# Altium project ESP32_Weather.PrjPcb
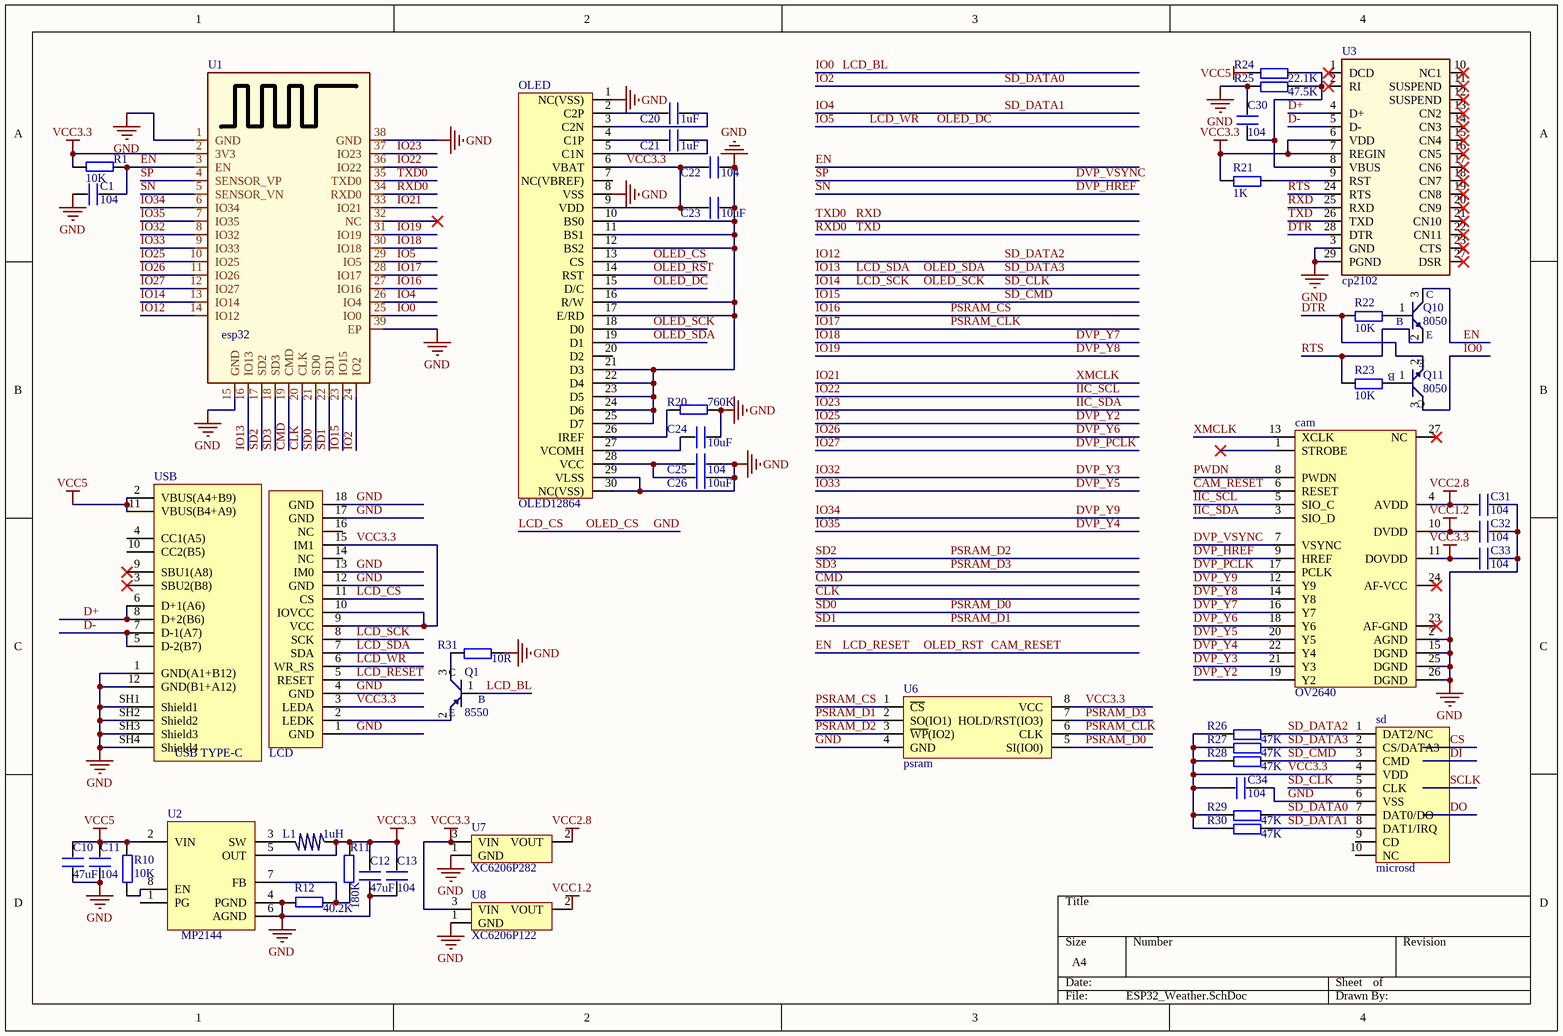
[diagram p0: ESP32_Weather.SchDoc]
1 sheet, 48 parts. Net scope: global (net labels, ports and power ports of the same name join across sheets).
Board file: ESP32_Weather.PcbDoc

## Sheet ESP32_Weather.SchDoc
size A4

### Parts
C1  104  [C 0603_L]
C10  47uF  [C 0805_L]
C11  104  [C 0603_L]
C12  47uF  [C 0805_L]
C13  104  [C 0603_L]
C20  1uF  [C 0603_L]
C21  1uF  [C 0603_L]
C22  104  [C 0603_L]
C23  10uF  [C 0603_L]
C24  10uF  [C 0603_L]
C25  104  [C 0603_L]
C26  10uF  [C 0603_L]
C30  104  [C 0603_L]
C31  104  [C 0603_L]
C32  104  [C 0603_L]
C33  104  [C 0603_L]
C34  104  [C 0603_L]
cam  OV2640  [OV5640]
L1  1uH  [NR3015]
LCD  LCD-TFT-H13TS38A  [TFT-H13TS43B]  (value not drawn)
OLED  OLED12864  [OLED_0.96]
Q1  8550  [SOT23-3L]
Q10  8050  [SOT23-3L]
Q11  8050  [SOT23-3L]
R1  10K  [R 0603_L]
R10  10K  [R 0603_L]
R11  180K  [R 0603_L]
R12  40.2K  [R 0603_L]
R20  760K  [R 0603_L]
R21  1K  [R 0603_L]
R22  10K  [R 0603_L]
R23  10K  [R 0603_L]
R24  22.1K  [R 0603_L]
R25  47.5K  [R 0603_L]
R26  47K  [R 0603_L]
R27  47K  [R 0603_L]
R28  47K  [R 0603_L]
R29  47K  [R 0603_L]
R30  47K  [R 0603_L]
R31  10R  [R 0603_L]
sd  microsd  [microsd3]
U1  esp32  [ESP32]
U2  MP2144  [SOT23-8L]
U3  cp2102  [QFN28 5x5_N]
U6  psram  [SOP8_L]
U7  XC6206P282  [SOT23-3L]
U8  XC6206P122  [SOT23-3L]
USB  USB TypeC  [USB Type-C]  (value not drawn)

### Nets
GND: C1.1 C10.1 C11.1 C12.1 C13.1 C22.1 C23.1 C24.1 C25.1 C26.1 C30.1 C31.2 C32.2 C33.2 C34.2 cam.2(AGND) cam.15(DGND) cam.25(DGND) cam.26(DGND) LCD.1(GND) LCD.4(GND) LCD.11(CS) LCD.12(GND) LCD.13(IM0) LCD.17(GND) LCD.18(GND) OLED.1(NC(VSS)) OLED.8(VSS) OLED.10(BS0) OLED.11(BS1) OLED.12(BS2) OLED.13(CS) OLED.16(R/W) OLED.17(E/RD) OLED.21(D3) OLED.22(D4) OLED.23(D5) OLED.24(D6) OLED.25(D7) OLED.29(VLSS) OLED.30(NC(VSS)) R12.2 R20.1 R25.1 R31.2 sd.6(VSS) U1.1(GND) U1.15(GND) U1.38(GND) U1.39(EP) U2.4(PGND) U2.6(AGND) U3.3(GND) U3.29(PGND) U6.4(GND) U7.1(GND) U8.1(GND) USB.1(GND(A1+B12)) USB.12(GND(B1+A12)) USB.SH1(Shield1) USB.SH2(Shield2) USB.SH3(Shield3) USB.SH4(Shield4)  [also labelled LCD_CS, OLED_CS]
VCC1.2: C32.1 cam.10(DVDD) U8.2(VOUT)
VCC2.8: C31.1 cam.4(AVDD) U7.2(VOUT)
VCC3.3: C12.2 C13.2 C22.2 C23.2 C33.1 C34.1 cam.11(DOVDD) L1.1 LCD.3(LEDA) LCD.9(VCC) LCD.10(IOVCC) LCD.15(IM1) OLED.6(VBAT) OLED.9(VDD) R1.2 R11.1 R21.1 R26.1 R27.1 R28.1 R29.1 R30.1 sd.4(VDD) U1.2(3V3) U2.5(OUT) U3.6(VDD) U3.7(REGIN) U6.8(VCC) U7.3(VIN) U8.3(VIN)
VCC5: C10.2 C11.2 R10.2 R24.1 U2.2(VIN) USB.2(VBUS(A4+B9)) USB.11(VBUS(B4+A9))
CAM_RESET: C1.2 cam.6(RESET) LCD.5(RESET) OLED.14(RST) Q10.3(C) R1.1 U1.3(EN)  [also labelled EN, LCD_RESET, OLED_RST]
CLK: U1.20(CLK)
CMD: U1.19(CMD)
D+: U3.4(D+) USB.6(D+1(A6)) USB.8(D+2(B6))
D-: U3.5(D-) USB.5(D-2(B7)) USB.7(D-1(A7))
DTR: Q11.2(E) R22.1 U3.28(DTR)
DVP_HREF: cam.9(HREF) U1.5(SENSOR_VN)  [also labelled SN]
DVP_PCLK: cam.17(PCLK) U1.12(IO27)  [also labelled IO27]
DVP_VSYNC: cam.7(VSYNC) U1.4(SENSOR_VP)  [also labelled SP]
DVP_Y2: cam.19(Y2) U1.10(IO25)  [also labelled IO25]
DVP_Y3: cam.21(Y3) U1.8(IO32)  [also labelled IO32]
DVP_Y4: cam.22(Y4) U1.7(IO35)  [also labelled IO35]
DVP_Y5: cam.20(Y5) U1.9(IO33)  [also labelled IO33]
DVP_Y6: cam.18(Y6) U1.11(IO26)  [also labelled IO26]
DVP_Y7: cam.16(Y7) U1.30(IO18)  [also labelled IO18]
DVP_Y8: cam.14(Y8) U1.31(IO19)  [also labelled IO19]
DVP_Y9: cam.12(Y9) U1.6(IO34)  [also labelled IO34]
IIC_SCL: cam.5(SIO_C) U1.36(IO22)  [also labelled IO22]
IIC_SDA: cam.3(SIO_D) U1.37(IO23)  [also labelled IO23]
IO0: Q1.1(B) Q11.3(C) U1.25(IO0)  [also labelled LCD_BL]
IO2: R29.2 sd.7(DAT0/DO) U1.24(IO2)  [also labelled SD_DATA0]
IO4: R30.2 sd.8(DAT1/IRQ) U1.26(IO4)  [also labelled SD_DATA1]
IO5: LCD.6(WR_RS) OLED.15(D/C) U1.29(IO5)  [also labelled LCD_WR, OLED_DC]
IO12: R26.2 sd.1(DAT2/NC) U1.14(IO12)  [also labelled SD_DATA2]
IO13: LCD.7(SDA) OLED.19(D1) R27.2 sd.2(CS/DATA3) U1.16(IO13)  [also labelled LCD_SDA, OLED_SDA, SD_DATA3]
IO14: LCD.8(SCK) OLED.18(D0) sd.5(CLK) U1.13(IO14)  [also labelled LCD_SCK, OLED_SCK, SD_CLK]
IO15: R28.2 sd.3(CMD) U1.23(IO15)  [also labelled SD_CMD]
IO16: U1.27(IO16) U6.1(~{CS})  [also labelled PSRAM_CS]
IO17: U1.28(IO17) U6.6(CLK)  [also labelled PSRAM_CLK]
IO21: cam.13(XCLK) U1.33(IO21)  [also labelled XMCLK]
PSRAM_D0: U1.21(SD0) U6.5(SI(IO0))  [also labelled SD0]
PSRAM_D1: U1.22(SD1) U6.2(SO(IO1))  [also labelled SD1]
PSRAM_D2: U1.17(SD2) U6.3(~{WP}(IO2))  [also labelled SD2]
PSRAM_D3: U1.18(SD3) U6.7(HOLD/RST(IO3))  [also labelled SD3]
PWDN: cam.8(PWDN)
RTS: Q10.2(E) R23.1 U3.24(RTS)
RXD: U1.35(TXD0) U3.25(RXD)  [also labelled TXD0]
RXD0: U1.34(RXD0) U3.26(TXD)  [also labelled TXD]
NetC20_1: C20.1 OLED.3(C2N)
NetC20_2: C20.2 OLED.2(C2P)
NetC21_1: C21.1 OLED.5(C1N)
NetC21_2: C21.2 OLED.4(C1P)
NetC24_2: C24.2 OLED.27(VCOMH)
NetC25_2: C25.2 C26.2 OLED.28(VCC)
NetC30_2: C30.2 R24.2 R25.2 U3.8(VBUS)
NetL1_2: L1.2 U2.3(SW)
NetLCD_2: LCD.2(LEDK) Q1.2(E)
NetOLED_26: OLED.26(IREF) R20.2
NetQ1_3: Q1.3(C) R31.1
NetQ10_1: Q10.1(B) R22.2
NetQ11_1: Q11.1(B) R23.2
NetR10_1: R10.1 U2.8(EN)
NetR11_2: R11.2 R12.1 U2.7(FB)
NetR21_2: R21.2 U3.9(RST)

Not connected (* = marked no-connect by the designer): cam 1(STROBE)* 23(AF-GND)* 24(AF-VCC)* 27(NC)*; LCD 14(NC) 16(NC); OLED 7(NC(VBREF)) 20(D2); sd 9(CD) 10(NC); U1 32(NC)*; U2 1(PG); U3 1(DCD)* 2(RI)* 10(NC1)* 11(SUSPEND)* 12(SUSPEND)* 13(CN2)* 14(CN3)* 15(CN4)* 16(CN5)* 17(CN6)* 18(CN7)* 19(CN8)* 20(CN9)* 21(CN10)* 22(CN11)* 23(CTS)* 27(DSR)*; USB 3(SBU2(B8))* 4(CC1(A5)) 9(SBU1(A8))* 10(CC2(B5))

### Notes on the sheet
- (in symbol USB Type-C) USB TYPE-C

### Library data of the parts
C1 C10-C13 C20-C26 C30-C34 = C
cam = OV5640
L1 = L
LCD = LCD-TFT-H13TS38A: LCD,TFT,1.3'240*240,禹龙
Q1 = 8550PNP
Q10 Q11 = 8050NPN
R1 R10-R12 R20-R31 = R
U6 = w25q256
U7 U8 = XC6206: LDO,SOT23,1.2~5.0V
USB = USB Type-C: 12P TypeC 母座